# Altium project mdriver2_power_hw.PrjPcb
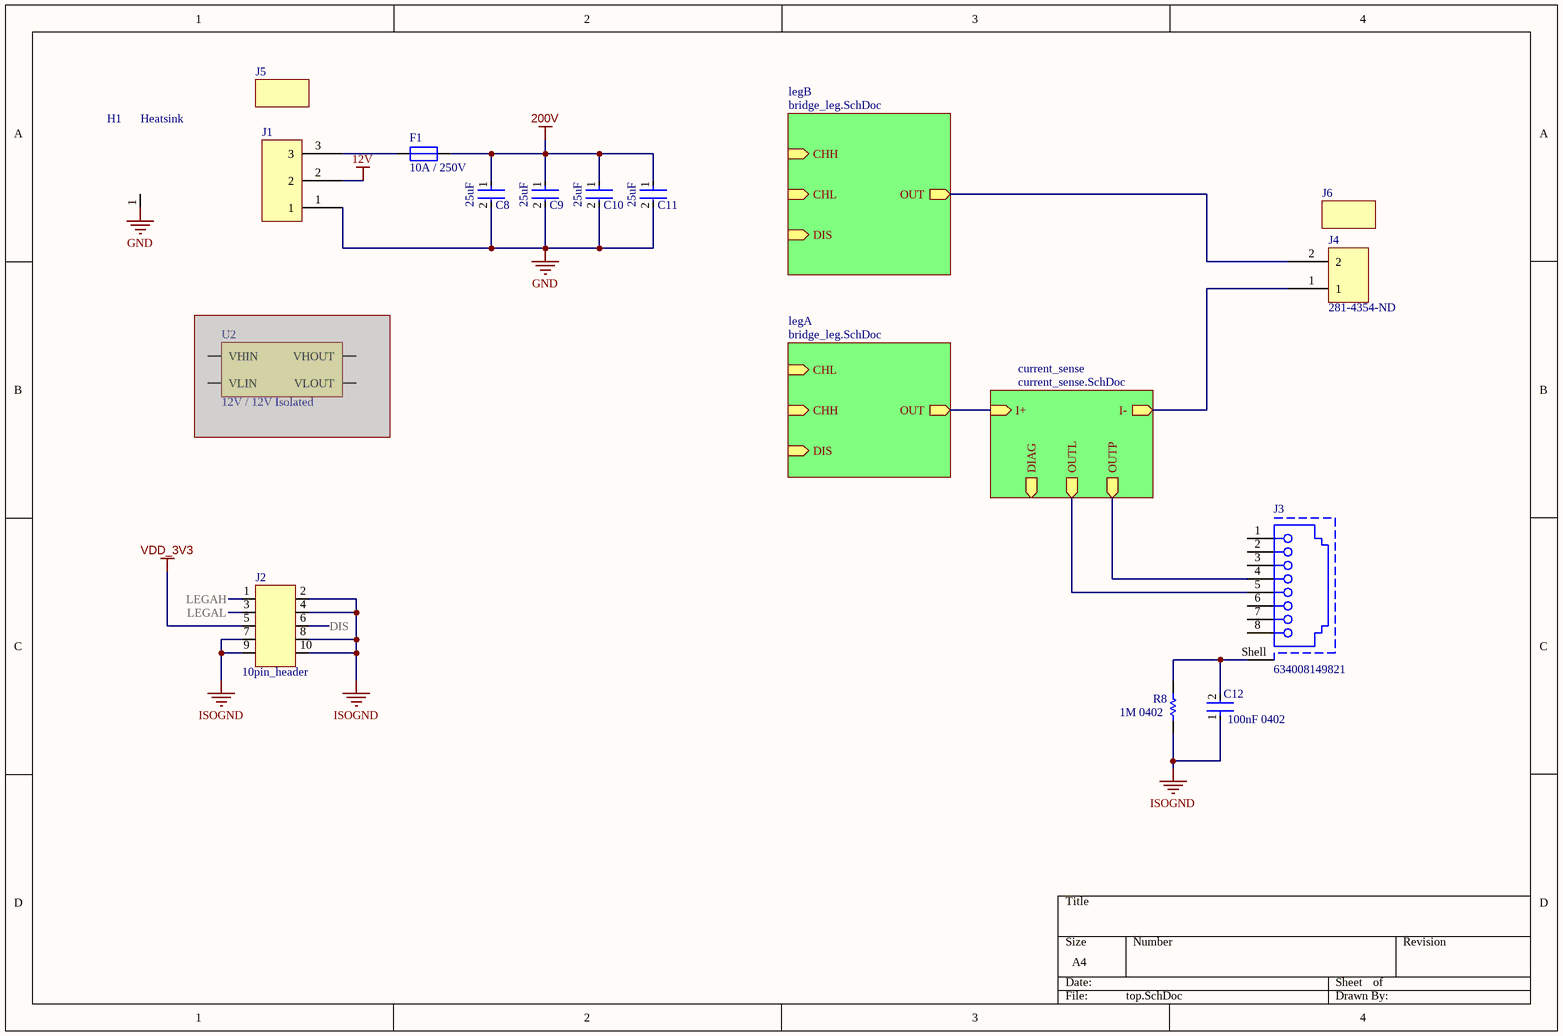
[diagram p0: top.SchDoc]
3 sheets, 60 parts. Net scope: hierarchical (ports join the sheet entries above them; power ports are global).
Board file: power.PcbDoc
Sheets:
  top.SchDoc
    legA = bridge_leg.SchDoc
    legB = bridge_leg.SchDoc
    current_sense = current_sense.SchDoc

## Sheet top.SchDoc
size A4; SheetNumber: 1; SheetTotal: 3; SPICEModelCacheAWJVRFAX: <root> / <DocumentId>AWJVRFAX</DocumentId> / </root>

### Parts
C8  25uF  [film_cap_50uF]
C9  25uF  [film_cap_50uF]
C10  25uF  [film_cap_50uF]
C11  25uF  [film_cap_50uF]
C12  100nF 0402  [CAP 0402_1005 RF]
F1  10A / 250V  [fuseholder_5mm_20mm]
H1  Heatsink  [HEATSINK2]
J1  20A Socket 3Pin  [weidmuller_3p_20A]  (value not drawn)
J2  10pin_header  [header_10]
J3  634008149821  [634008149821]
J4  Supplier Part Number 1: 281-4354-ND  [weidmuller_19A_2p_m]  (hidden comment: weidmuller_20A_2p_f)
J5  20A Power Plug 3 Pin  (value not drawn)
J6  20A Power Plug 2 Pin  (value not drawn)
R8  1M 0402  [RES 0402_1005]
U2  12V / 12V Isolated  [gatesupply]  (masked out: inside a compile mask, not in the netlist)

### Sub-sheets
current_sense = current_sense.SchDoc: I+ (in), I- (out), DIAG (out), OUTP (out), OUTL (out)
legA = bridge_leg.SchDoc: CHL (in), CHH (in), DIS (in), OUT (out)
legB = bridge_leg.SchDoc: CHH (in), CHL (in), DIS (in), OUT (out)

### Nets
12V: J1.2
200V: C8.1 C9.1 C10.1 C11.1 F1.1
GND: C8.2 C9.2 C10.2 C11.2 H1.1 J1.1
ISOGND: C12.1 J2.2 J2.4 J2.7 J2.8 J2.9 J2.10 R8.2
VDD_3V3: J2.5
DIS: J2.6
LEGAH: J2.1
LEGAL: J2.3
NetC3_legA_2: sheet legA/OUT, sheet current_sense/I+
NetC3_legB_2: J4.2 ; sheet legB/OUT
NetC12_2: C12.2 J3.Shell R8.1
NetF1_2: F1.2 J1.3
NetFB2_1: J4.1 ; sheet current_sense/I-
NetJ3_4: J3.4 ; sheet current_sense/OUTP
NetJ3_5: J3.5 ; sheet current_sense/OUTL

Not connected (* = marked no-connect by the designer): J3 1 2 3 6 7 8

### Library data of the parts
C8-C11 = b4654b650e69147ec39a6b967a45e02: FIlm Cap 25uF 450V; Voltage: 50V; Tolerance: 5%; Dielectric: C0G; Insulation Resistance: 1GR; Dissipation Factor: 2.5%; Temperature Coefficient: 30ppm/°C; Capacitance: 100pF; REACH SVHC: No SVHC; Termination: SMD/SMT; Construction: Flat; Contact Plating: Tin; Width: 0.02inch; Series: -; Voltage Rating (DC): 50V; Voltage Rating: 50V; Height: 0.56mm; Max Operating Temperature: 125°C; Length: 1mm; Lead Free: Lead Free; Case/Package: 0402; Min Operating Temperature: -55°C; Depth: 0.5mm; Case Code (Metric): 1005; Thickness: 0.022inch; Radiation Hardening: No; Case Code (Imperial): 0402; Mount: Surface Mount; Packaging: Tape and Reel; Package Quantity: 1; RoHS Compliant: Yes
C12 = b4654b650e69147ec39a6b967a45e02: MLCC 0402 100nF; Voltage: 50V; Tolerance: 5%; Dielectric: C0G; Insulation Resistance: 1GR; Dissipation Factor: 2.5%; Temperature Coefficient: 30ppm/°C; REACH SVHC: No SVHC; Termination: SMD/SMT; Construction: Flat; Contact Plating: Tin; Width: 0.02inch; Series: -; Voltage Rating (DC): 50V; Voltage Rating: 50V; Height: 0.56mm; Max Operating Temperature: 125°C; Length: 1mm; Lead Free: Lead Free; Case/Package: 0402; Min Operating Temperature: -55°C; Depth: 0.5mm; Case Code (Metric): 1005; Thickness: 0.022inch; Radiation Hardening: No; Case Code (Imperial): 0402; Mount: Surface Mount; Capacitance: 100nF; Packaging: Tape and Reel; Package Quantity: 1; RoHS Compliant: Yes; Supplier 1: Future Electronics; Supplier Part Number 1: 5964861
F1 = fuse: Fuse Holder 5mm/20mm; Supplier 1: Rs; Supplier Part Number 1: 2693785
H1 = heatsink_2: HEATSINK TO247 W/CLIP 75MM; Supplier 1: Mouser; Supplier Part Number 1: 567-694-75
J1 = wuerth_connector_straight_30_20A_691311500103: Supplier 1: Rs; Supplier Part Number 1: 1722945
J2 = 10pin_header: Pin header male 2x5 2.54mm; Supplier 1: Digikey; Supplier Part Number 1: 1175-1754-ND
J3 = CMP-1502-01719-2: NexarPartId: 52676018; Current Rating: 1.5A; Contact Resistance: 20mΩ; Operating Supply Voltage: 120V; Insulation Resistance: 500MΩ; Number of Ports: 1; Shielding: Shielded; Direction: Up; Min Operating Temperature: -40°C; Housing Color: Black; Max Operating Temperature: 85°C; Contact Plating: Gold; Number of Rows: 1; Termination: Solder; Mount: Surface Mount; RoHS: Compliant; Housing Material: Nylon
J4 = weidmuller_20A_2p_f: Connector Block 19A Male Receptor; Supplier 1: Digi-Key
J5 J6 = weidmuller_3pin_male: Supplier 1: Rs
  J5: Supplier Part Number 1: 1722695
  J6: Supplier Part Number 1: 1722635
R8 = Res1: Resistor 10MOhm 0603; Value: 1Meg; Published: 8-Jun-2000; LatestRevisionDate: 17-Jul-2002; LatestRevisionNote: Re-released for DXP Platform.; PackageReference: AXIAL-0.3; Publisher: Altium Limited; PackageDescription: Axial Device, Thru-Hole; 2 Leads; 0.3 in Pin Spacing; Supplier 1: Mouser; Supplier Part Number 1: 279-CRGP0402F1M0
U2 = gatesupply: Supplier 1: Digikey; Supplier Part Number 1: 811-3184-1-ND

## Sheet bridge_leg.SchDoc
size A4; SheetNumber: 2; SheetTotal: 3
Used 2 times, as channels legA, legB. Parts and nets are listed once, with the designators drawn on the sheet.
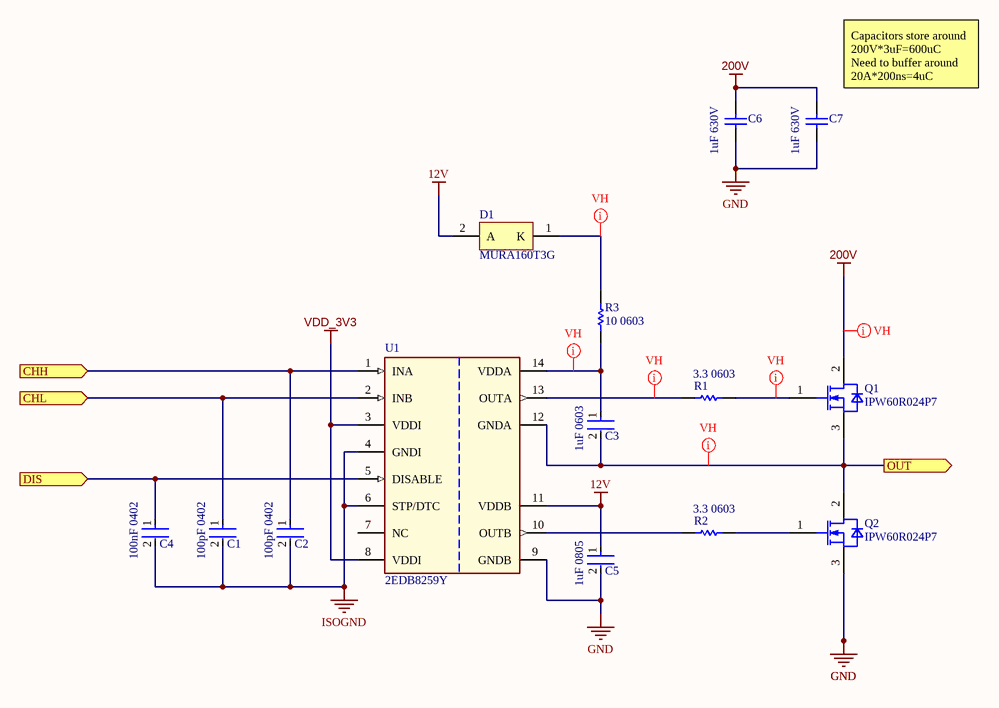
[diagram p1: bridge_leg.SchDoc]

### Parts
C1  100pF 0402  [CAP 0402_1005 RF]
C2  100pF 0402  [CAP 0402_1005 RF]
C3  1uF 0603  [CAP 0805_2012]
C4  100nF 0402  [CAP 0402_1005 RF]
C5  1uF 0805  [CAP 0805_2012]
C6  1uF 630V  [CAP 2220_5650 2.5MM]
C7  1uF 630V  [CAP 2220_5650 2.5MM]
D1  MURA160T3G  [ONSC-SMA-2-403D-02_V]
Q1  IPW60R024P7  [INF-PG-TO247-3]
Q2  IPW60R024P7  [INF-PG-TO247-3]
R1  3.3 0603  [RES 0603_1608]
R2  3.3 0603  [RES 0603_1608]
R3  10 0603  [RES 0603_1608]
U1  2EDB8259Y  [SOIC127P600X175-16_14N-1-V]

### Ports
CHH (in), CHL (in), DIS (in), OUT (out)

### Nets
12V: C5.1 D1.2(A) U1.11(VDDB)
200V: C6.2 C7.2 Q1.2(DRAIN)
GND: C5.2 C6.1 C7.1 Q2.3(SOURCE) U1.9(GNDB)
ISOGND: C1.2 C2.2 C4.2 U1.4(GNDI) U1.6(STP/DTC)
VDD_3V3: U1.3(VDDI) U1.8(VDDI)
CHH: C2.1 U1.1(INA) ; port CHH
CHL: C1.1 U1.2(INB) ; port CHL
DIS: C4.1 U1.5(DISABLE) ; port DIS
OUT: C3.2 Q1.3(SOURCE) Q2.2(DRAIN) U1.12(GNDA) ; port OUT
NetC3_1: C3.1 R3.1 U1.14(VDDA)
NetD1_1: D1.1(K) R3.2
NetQ1_1: Q1.1(GATE) R1.2
NetQ2_1: Q2.1(GATE) R2.2
NetR1_1: R1.1 U1.13(OUTA)
NetR2_1: R2.1 U1.10(OUTB)

Not connected (* = marked no-connect by the designer): U1 7(NC)

### Channels
legA: designators end in _legA; ports CHH=NetC2_legA_1 CHL=NetC1_legA_1 DIS=NetC4_legA_1 OUT=NetC3_legA_2
legB: designators end in _legB; ports CHH=NetC2_legB_1 CHL=NetC1_legB_1 DIS=NetC4_legB_1 OUT=NetC3_legB_2

### Layout directives
net class VH: 200V, NetC3_legA_1, NetC3_legA_2, NetD1_legA_1, NetQ1_legA_1, NetR1_legA_1

### Notes on the sheet
- (near C7) Capacitors store around 200V*3uF=600uC
  Need to buffer around 20A*200ns=4uC

### Library data of the parts
C1 C2 C4 = b4654b650e69147ec39a6b967a45e02: MLCC 0402 100pF; Voltage: 50V; Tolerance: 5%; Dielectric: C0G; Insulation Resistance: 1GR; Dissipation Factor: 2.5%; Temperature Coefficient: 30ppm/°C; REACH SVHC: No SVHC; Termination: SMD/SMT; Construction: Flat; Contact Plating: Tin; Width: 0.02inch; Series: -; Voltage Rating (DC): 50V; Voltage Rating: 50V; Height: 0.56mm; Max Operating Temperature: 125°C; Length: 1mm; Lead Free: Lead Free; Case/Package: 0402; Min Operating Temperature: -55°C; Depth: 0.5mm; Case Code (Metric): 1005; Thickness: 0.022inch; Radiation Hardening: No; Case Code (Imperial): 0402; Mount: Surface Mount; Capacitance: 100pF; Packaging: Tape and Reel; Package Quantity: 1; RoHS Compliant: Yes
  C4: Supplier 1: Future Electronics; Supplier Part Number 1: 5964861
C3 C5 = b4654b650e69147ec39a6b967a45e02: MLCC 0805 1uF; Voltage: 50V; Tolerance: 5%; Dielectric: C0G; Insulation Resistance: 1GR; Dissipation Factor: 2.5%; Temperature Coefficient: 30ppm/°C; REACH SVHC: No SVHC; Termination: SMD/SMT; Construction: Flat; Contact Plating: Tin; Width: 0.02inch; Series: -; Voltage Rating (DC): 50V; Voltage Rating: 50V; Height: 0.56mm; Max Operating Temperature: 125°C; Length: 1mm; Lead Free: Lead Free; Case/Package: 0402; Min Operating Temperature: -55°C; Depth: 0.5mm; Case Code (Metric): 1005; Thickness: 0.022inch; Radiation Hardening: No; Case Code (Imperial): 0402; Mount: Surface Mount; Capacitance: 1uF; Packaging: Tape and Reel; Package Quantity: 1; RoHS Compliant: Yes; Supplier 1: Mouser; Supplier Part Number 1: 80-C0603C105K3R
C6 C7 = Capacitor_Non-Polarized: MLCC 1Uf, 630V, Mlcc, 2220 Rohs Compliant: Yes; NexarPartId: 133607636; Capacitance: 1µF; Insulation Resistance: 100MΩ; RoHS: Compliant; Length: 5.7mm; Height: 5mm; Min Operating Temperature: -55°C; Width: 2.8mm; Voltage Rating: 630V; Max Operating Temperature: 125°C; Supplier 1: Rs; Supplier Part Number 1: 2610080
D1 = CMP-0894-00005-3: Surface Mount Ultrafast Power Rectifier, 2-Pin SMA, Pb-Free, Tape and Reel; Manufacturer: On Semiconductor; IFSM Max (A): 30; VRRM Max (V): 600; Type: Ultrafast; ComponentLink1URL: http://www.onsemi.com/; PackageDescription: 2-Pin Small Molded Package, J-Bend Lead, Body 2.605 x 4.315 mm; ComponentLink3Description: Package Specification; ComponentLink2Description: Datasheet; PartNumber: MURA160T3G; RoHS: TRUE; ComponentLink2URL: http://www.onsemi.cn/pub_link/Collateral/MURA160T3-D.PDF; ComponentLink1Description: Manufacturer URL; Packing: Tape and Reel; PackageReference: SMA-2-403D-02; ComponentLink3URL: http://www.onsemi.com/pub_link/Collateral/403D-02.PDF; PackageVersion: Rev. G, 07/2012; Mounting Technology: Surface Mount; DatasheetVersion: Rev. 6
Q1 Q2 = IPW60R024P7: Smart Low Side Power Switch; Manufacturer: Infineon Technologies; Manufacturer Order Number: IPW60R024P7; PackageReference: PG-TO247-3-41; Supplier 1: Mouser; Supplier Part Number 1: 726-IPW60R024P7XKSA1
R1 R2 = Res1: Resistor 3.3Ohm 0603; Value: 3.3; Published: 8-Jun-2000; LatestRevisionDate: 17-Jul-2002; LatestRevisionNote: Re-released for DXP Platform.; PackageReference: AXIAL-0.3; Publisher: Altium Limited; PackageDescription: Axial Device, Thru-Hole; 2 Leads; 0.3 in Pin Spacing
R3 = Res1: Resistor 10Ohm 0603; Value: 10; Published: 8-Jun-2000; LatestRevisionDate: 17-Jul-2002; LatestRevisionNote: Re-released for DXP Platform.; PackageReference: AXIAL-0.3; Publisher: Altium Limited; PackageDescription: Axial Device, Thru-Hole; 2 Leads; 0.3 in Pin Spacing; Supplier 1: Mouser; Supplier Part Number 1: 71-CRCW0603-10-E3
U1 = 2EDB8259Y: Dual-Channel Isolated Gate Driver; Manufacturer: Infineon Technologies; Manufacturer Order Number: 2EDB8259Y; PackageReference: PG-DSO-14; Supplier 1: Mouser; Supplier Part Number 1: 726-2EDB8259YXUMA1

## Sheet current_sense.SchDoc
size A4; SheetNumber: 3; SheetTotal: 3
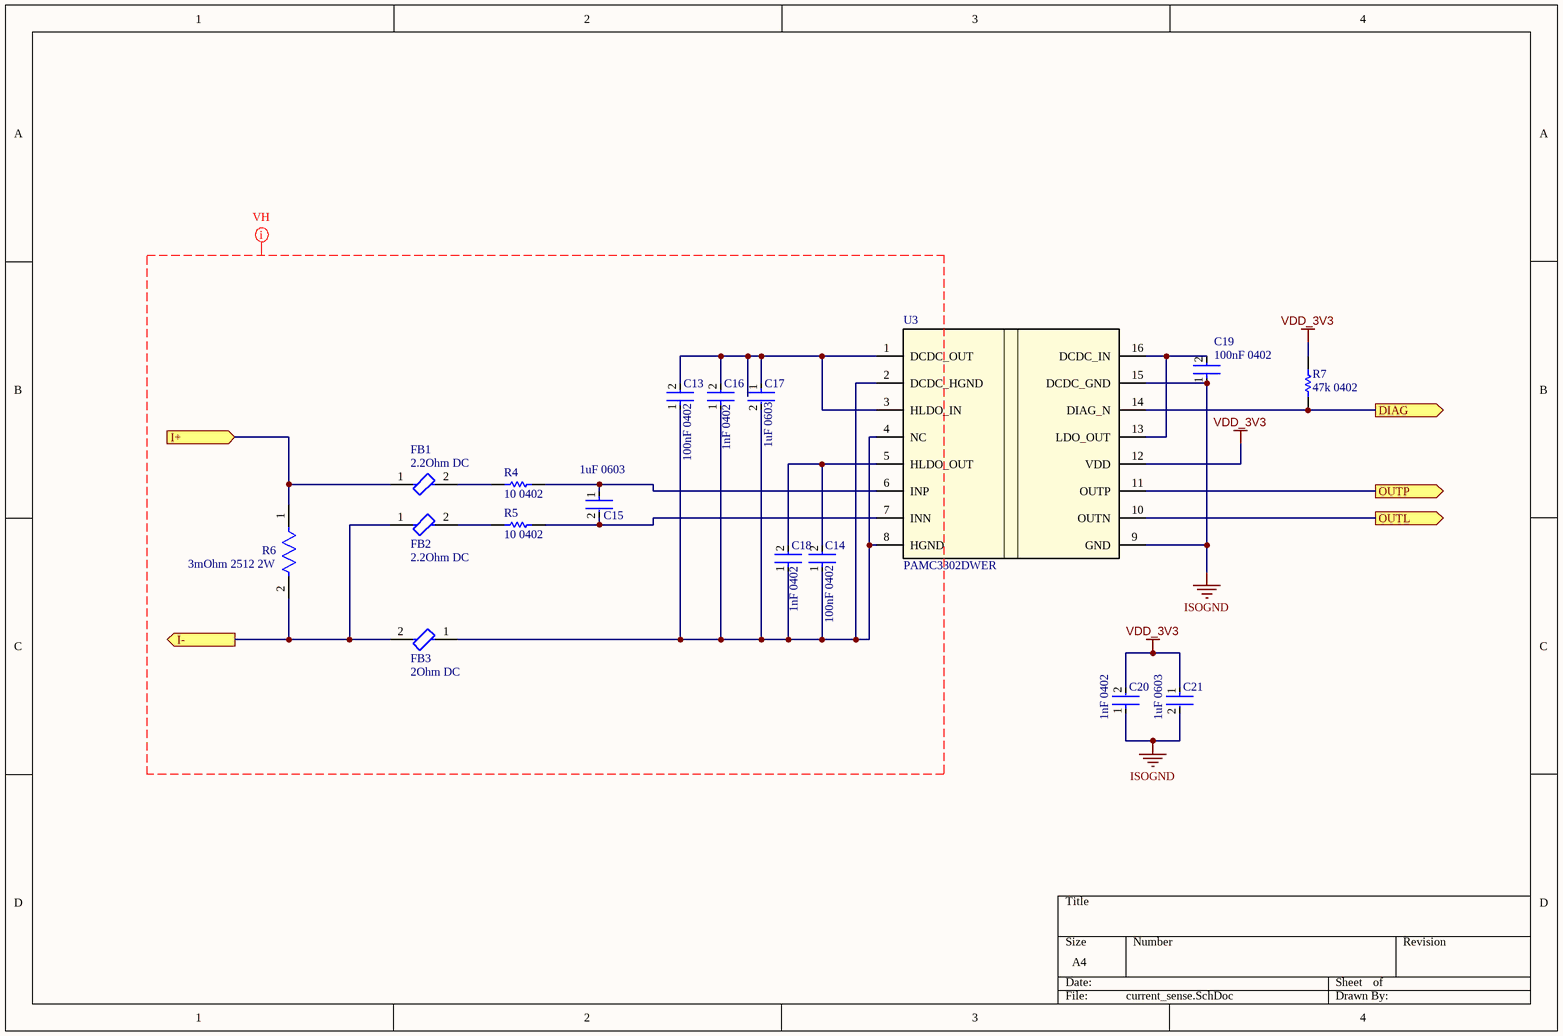
[diagram p2: current_sense.SchDoc]

### Parts
C13  100nF 0402  [CAP 0402_1005 RF]
C14  100nF 0402  [CAP 0402_1005 RF]
C15  1uF 0603  [CAP 0603_1608]
C16  1nF 0402  [CAP 0402_1005 RF]
C17  1uF 0603  [CAP 0603_1608]
C18  1nF 0402  [CAP 0402_1005 RF]
C19  100nF 0402  [CAP 0402_1005 RF]
C20  1nF 0402  [CAP 0402_1005 RF]
C21  1uF 0603  [CAP 0603_1608]
FB1  2.2Ohm DC  [FER 0402_1005]
FB2  2.2Ohm DC  [FER 0402_1005]
FB3  2Ohm DC  [FP-BKH1005-MFG]
R4  10 0402  [RES 0402_1005]
R5  10 0402  [RES 0402_1005]
R6  3mOhm 2512 2W  [FP-CSNL2512-MFG]
R7  47k 0402  [RES 0402_1005]
U3  PAMC3302DWER  [DWE0016A-IPC_A]

### Ports
DIAG (out), I+ (in), I- (out), OUTL (out), OUTP (out)

### Nets
ISOGND: C19.1 C20.1 C21.2 U3.9(GND) U3.15(DCDC_GND)
VDD_3V3: C20.2 C21.1 R7.1 U3.12(VDD)
NetC3_legA_2: FB1.1 R6.1 ; port I+
NetC13_1: C13.1 C14.1 C16.1 C17.2 C18.1 FB3.1 U3.2(DCDC_HGND) U3.4(NC) U3.8(HGND)
NetC13_2: C13.2 C16.2 C17.1 U3.1(DCDC_OUT) U3.3(HLDO_IN)
NetC14_2: C14.2 C18.2 U3.5(HLDO_OUT)
NetC15_1: C15.1 R4.1 U3.6(INP)
NetC15_2: C15.2 R5.1 U3.7(INN)
NetC19_2: C19.2 U3.13(LDO_OUT) U3.16(DCDC_IN)
NetFB1_2: FB1.2 R4.2
NetFB2_1: FB2.1 FB3.2 R6.2 ; port I-
NetFB2_2: FB2.2 R5.2
NetJ3_4: U3.11(OUTP) ; port OUTP
NetJ3_5: U3.10(OUTN) ; port OUTL
NetR7_2: R7.2 U3.14(DIAG_N) ; port DIAG

### Layout directives
net class VH: (no net found under the mark)

### Library data of the parts
C13 C14 C19 = b4654b650e69147ec39a6b967a45e02: as C12 on sheet top; REACH SVHC: No SVHC; Termination: SMD/SMT; Construction: Flat; Contact Plating: Tin; Width: 0.02inch; Series: -; Voltage Rating (DC): 50V; Voltage Rating: 50V; Height: 0.56mm; Max Operating Temperature: 125°C; Length: 1mm; Lead Free: Lead Free; Case/Package: 0402; Min Operating Temperature: -55°C; Depth: 0.5mm; Case Code (Metric): 1005; Thickness: 0.022inch; Radiation Hardening: No; Case Code (Imperial): 0402; Mount: Surface Mount; Capacitance: 100nF; Packaging: Tape and Reel; Package Quantity: 1; RoHS Compliant: Yes; Supplier 1: Future Electronics; Supplier Part Number 1: 5964861
C15 = b4654b650e69147ec39a6b967a45e02: as C1 on sheet bridge_leg; REACH SVHC: No SVHC; Termination: SMD/SMT; Construction: Flat; Contact Plating: Tin; Width: 0.02inch; Series: -; Voltage Rating (DC): 50V; Voltage Rating: 50V; Height: 0.56mm; Max Operating Temperature: 125°C; Length: 1mm; Lead Free: Lead Free; Case/Package: 0402; Min Operating Temperature: -55°C; Depth: 0.5mm; Case Code (Metric): 1005; Thickness: 0.022inch; Radiation Hardening: No; Case Code (Imperial): 0402; Mount: Surface Mount; Capacitance: 1uF; Packaging: Tape and Reel; Package Quantity: 1; RoHS Compliant: Yes; Supplier 1: Future Electronics; Supplier Part Number 1: 9043971
C16 C18 C20 = b4654b650e69147ec39a6b967a45e02: MLCC 0402 1nF; Voltage: 50V; Tolerance: 5%; Dielectric: C0G; Insulation Resistance: 1GR; Dissipation Factor: 2.5%; Temperature Coefficient: 30ppm/°C; REACH SVHC: No SVHC; Termination: SMD/SMT; Construction: Flat; Contact Plating: Tin; Width: 0.02inch; Series: -; Voltage Rating (DC): 50V; Voltage Rating: 50V; Height: 0.56mm; Max Operating Temperature: 125°C; Length: 1mm; Lead Free: Lead Free; Case/Package: 0402; Min Operating Temperature: -55°C; Depth: 0.5mm; Case Code (Metric): 1005; Thickness: 0.022inch; Radiation Hardening: No; Case Code (Imperial): 0402; Mount: Surface Mount; Capacitance: 1nF; Packaging: Tape and Reel; Package Quantity: 1; RoHS Compliant: Yes; Supplier 1: Future Electronics; Supplier Part Number 1: 7077183
C17 C21 = b4654b650e69147ec39a6b967a45e02: MLCC 0603 1uF; Voltage: 50V; Tolerance: 5%; Dielectric: C0G; Insulation Resistance: 1GR; Dissipation Factor: 2.5%; Temperature Coefficient: 30ppm/°C; REACH SVHC: No SVHC; Termination: SMD/SMT; Construction: Flat; Contact Plating: Tin; Width: 0.02inch; Series: -; Voltage Rating (DC): 50V; Voltage Rating: 50V; Height: 0.56mm; Max Operating Temperature: 125°C; Length: 1mm; Lead Free: Lead Free; Case/Package: 0402; Min Operating Temperature: -55°C; Depth: 0.5mm; Case Code (Metric): 1005; Thickness: 0.022inch; Radiation Hardening: No; Case Code (Imperial): 0402; Mount: Surface Mount; Capacitance: 1uF; Packaging: Tape and Reel; Package Quantity: 1; RoHS Compliant: Yes; Supplier 1: Mouser; Supplier Part Number 1: 80-C0603C105K3R
FB1 FB2 = 5f30dd21d616792df468990f7003faa: Chip Ferrite Bead, 0402, 1800Ω @ 100MHz, 2.2Ω, 25%, 200mA; Impedance: 1.8kR; Number of Lines: 1; DC Resistance (DCR): 2.2R; Max Operating Temperature: 125°C; Packaging: Tape and Reel; Length: 0.039inch; Max Current Rating: 200mA; Mount: Surface Mount; Package Quantity: 10000; Ratings: AEC-Q200; Height: 0.022inch; Number of Circuits: 1; Case/Package: 0402; Min Operating Temperature: -55°C; Width: 0.02inch; RoHS Compliant: Yes; Supplier 1: Rs; Supplier Part Number 1: 332378
FB3 = CMP-14488-000017-2: 1.8 kOhms @ 100 MHz 1 Ferrite Bead 0402 (1005 Metric) 200mA 2Ohm; Number of Lines: 1; Impedance: 1.8kR; Tolerance: 25%; Test Frequency: 100MHz; DC Resistance (DCR): 2R; Case Code (Imperial): 0402; Mount: Surface Mount; Max Current Rating: 200mA; Max DC Current: 200mA; Length: 0.039inch; Case Code (Metric): 1005; Height: 0.022inch; Max Operating Temperature: 125°C; Packaging: Tape and Reel; Min Operating Temperature: -55°C; Package Quantity: 1; Lead Free: Lead Free; Series: BK; Depth: 0.55mm; Termination: SMD/SMT; Halogen Free: Halogen Free; RoHS Compliant: Yes; Width: 0.02inch; Case/Package: 0402
R4 R5 = Res1: Resistor 10Ohm 0603; Value: 10; Published: 8-Jun-2000; LatestRevisionDate: 17-Jul-2002; LatestRevisionNote: Re-released for DXP Platform.; PackageReference: AXIAL-0.3; Publisher: Altium Limited; PackageDescription: Axial Device, Thru-Hole; 2 Leads; 0.3 in Pin Spacing; Supplier 1: Future Electronics; Supplier Part Number 1: 2028518
R6 = CMP-26527-000012-1: RES 0.003 OHM 1% 2W 2512; 3DS Part Number: 110-00007; Manufacturer Part Number: CSNL2512FT3L00; Manufacturer: Stackpole; Value: 3mΩ; Temperature Coefficient: 50ppm/°C; Ipc Land Pattern Name: RESC635318X55; ComponentLink2Description: Datasheet; Octopart: https://octopart.com/csnl2512ft3l00-stackpole+electronics-19206420; ComponentLink2URL: https://www.seielect.com/Catalog/SEI-csnl.pdf; Device Class L2: Resistors; RoHS: TRUE; Temperature Range High: +170°C; Footprint Url: http://www.seielect.com/catalog/SEI-Std_Solder_Land_Patterns.pdf; Device Class L3: Chip SMD Resistors; Digikey Description: RES 0.003 OHM 1% 2W 2512; Temperature: -55°C to +170°C; Device Class L1: Passive Components; Lead Free: Yes; Category: Res; Series: CSNL; Resistance: 3mΩ; Temperature Range Low: -55°C; Composition: Metal Foil; Power Rating: 2W; Height: 0.75mm; Package: CSNL2512; Automotive: No; Tolerance: 1%
R7 = Res1: Resistor 47kOhm 0402; Published: 8-Jun-2000; LatestRevisionDate: 17-Jul-2002; LatestRevisionNote: Re-released for DXP Platform.; PackageReference: AXIAL-0.3; Publisher: Altium Limited; PackageDescription: Axial Device, Thru-Hole; 2 Leads; 0.3 in Pin Spacing; Value: 47k; Supplier 1: Mouser; Supplier Part Number 1: 71-CRCW0402-47K-E3
U3 = PAMC3302DWER: Â±50-mV input, precision reinforced isolated amplifier with integrated DC/DC converter 16-SOIC -40 to 125; Manufacturer_Name: Texas Instruments; TYPE: TYPE; RefDes: RefDes; Copyright: Copyright (C) 2025 Ultra Librarian. All rights reserved.; Manufacturer_Part_Number: PAMC3302DWER; Datasheet: https://www.ti.com/lit/gpn/amc3302

## Nets that join several sheets
12V: top (J1.2), legA (C5_legA.1 D1_legA.2 U1_legA.11), legB (C5_legB.1 D1_legB.2 U1_legB.11)
200V: top (5 pins), legA (C6_legA.2 C7_legA.2 Q1_legA.2), legB (C6_legB.2 C7_legB.2 Q1_legB.2)
GND: top (6 pins), legA (5 pins), legB (5 pins)
ISOGND: top (8 pins), legA (5 pins), legB (5 pins), current_sense (5 pins)
VDD_3V3: top (J2.5), legA (U1_legA.3 U1_legA.8), legB (U1_legB.3 U1_legB.8), current_sense (C20.2 C21.1 R7.1 U3.12)
NetC3_legA_2: legA (C3_legA.2 Q1_legA.3 Q2_legA.2 U1_legA.12), current_sense (FB1.1 R6.1)
NetC3_legB_2: top (J4.2), legB (C3_legB.2 Q1_legB.3 Q2_legB.2 U1_legB.12)
NetFB2_1: top (J4.1), current_sense (FB2.1 FB3.2 R6.2)
NetJ3_4: top (J3.4), current_sense (U3.11)
NetJ3_5: top (J3.5), current_sense (U3.10)